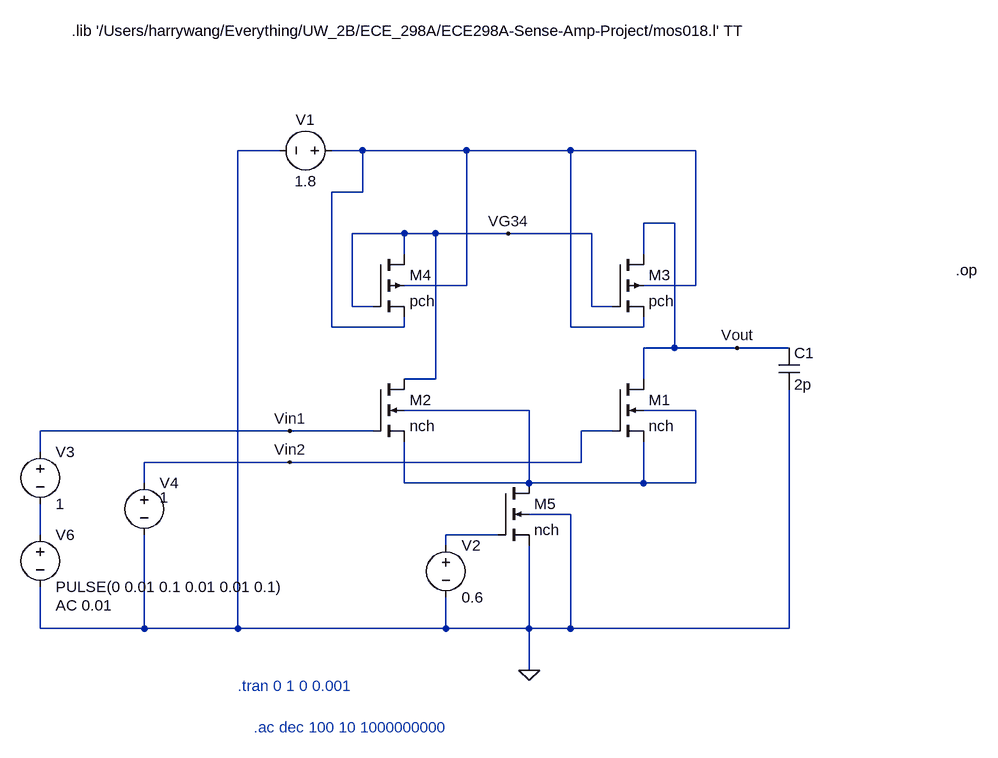
[diagram p0: schematic Sense_amp_alternate.asc]
Sense_amp_alternate.asc, the LTspice schematic file:
Version 4
SHEET 1 1660 680
WIRE -128 -256 -192 -256
WIRE 0 -256 -48 -256
WIRE 160 -256 0 -256
WIRE 320 -256 160 -256
WIRE 512 -256 320 -256
WIRE 0 -192 0 -256
WIRE 0 -192 -48 -192
WIRE 480 -144 432 -144
WIRE 64 -128 -16 -128
WIRE 112 -128 64 -128
WIRE 224 -128 112 -128
WIRE 352 -128 224 -128
WIRE 64 -96 64 -128
WIRE 432 -96 432 -144
WIRE 160 -48 160 -256
WIRE 160 -48 64 -48
WIRE 512 -48 512 -256
WIRE 512 -48 432 -48
WIRE -16 -16 -16 -128
WIRE 16 -16 -16 -16
WIRE 352 -16 352 -128
WIRE 384 -16 352 -16
WIRE -48 16 -48 -192
WIRE 64 16 64 0
WIRE 64 16 -48 16
WIRE 320 16 320 -256
WIRE 432 16 432 0
WIRE 432 16 320 16
WIRE 480 48 480 -144
WIRE 480 48 432 48
WIRE 576 48 480 48
WIRE 656 48 576 48
WIRE 112 96 112 -128
WIRE 112 96 64 96
WIRE 432 96 432 48
WIRE 256 144 64 144
WIRE 512 144 432 144
WIRE -112 176 -496 176
WIRE 16 176 -112 176
WIRE 384 176 336 176
WIRE -496 208 -496 176
WIRE -112 224 -336 224
WIRE 336 224 336 176
WIRE 336 224 -112 224
WIRE -336 256 -336 224
WIRE 64 256 64 192
WIRE 256 256 256 144
WIRE 256 256 64 256
WIRE 432 256 432 192
WIRE 432 256 256 256
WIRE 512 256 512 144
WIRE 512 256 432 256
WIRE 320 304 256 304
WIRE -496 336 -496 288
WIRE 208 336 128 336
WIRE 128 352 128 336
WIRE -496 480 -496 416
WIRE -336 480 -336 336
WIRE -336 480 -496 480
WIRE -192 480 -192 -256
WIRE -192 480 -336 480
WIRE 128 480 128 432
WIRE 128 480 -192 480
WIRE 256 480 256 352
WIRE 256 480 128 480
WIRE 320 480 320 304
WIRE 320 480 256 480
WIRE 656 480 656 112
WIRE 656 480 320 480
WIRE 256 544 256 480
FLAG 256 544 0
FLAG 576 48 Vout
FLAG -112 176 Vin1
FLAG -112 224 Vin2
FLAG 224 -128 VG34
SYMBOL voltage -32 -256 R90
WINDOW 0 -32 56 VBottom 2
WINDOW 3 32 56 VTop 2
WINDOW 123 0 0 Left 0
WINDOW 39 0 0 Left 0
SYMATTR InstName V1
SYMATTR Value 1.8
SYMBOL voltage 128 336 R0
WINDOW 123 0 0 Left 0
WINDOW 39 0 0 Left 0
SYMATTR InstName V2
SYMATTR Value 0.6
SYMBOL voltage -496 192 R0
WINDOW 123 0 0 Left 0
WINDOW 39 0 0 Left 0
SYMATTR Value 1
SYMATTR InstName V3
SYMBOL voltage -496 320 R0
WINDOW 123 24 124 Left 2
WINDOW 39 0 0 Left 0
SYMATTR Value2 AC 0.01
SYMATTR InstName V6
SYMATTR Value PULSE(0 0.01 0.1 0.01 0.01 0.1)
SYMBOL cap 640 48 R0
SYMATTR InstName C1
SYMATTR Value 2p
SYMBOL pmos4 384 -96 R0
SYMATTR InstName M3
SYMATTR Value pch
SYMATTR Value2 l=0.18e-6 w=1.0e-6
SYMBOL pmos4 16 -96 R0
SYMATTR InstName M4
SYMATTR Value pch
SYMATTR Value2 l=0.18e-6 w=1.0e-6
SYMBOL nmos4 384 96 R0
SYMATTR InstName M1
SYMATTR Value nch
SYMATTR Value2 l=0.18e-6 w=1.0e-6
SYMBOL nmos4 16 96 R0
SYMATTR InstName M2
SYMATTR Value nch
SYMATTR Value2 l=0.18e-6 w=1.0e-6
SYMBOL nmos4 208 256 R0
SYMATTR InstName M5
SYMATTR Value nch
SYMATTR Value2 l=0.32e-6 w=2.5e-6
SYMBOL voltage -336 240 R0
WINDOW 123 0 0 Left 0
WINDOW 39 0 0 Left 0
WINDOW 3 24 38 Left 2
SYMATTR Value 1
SYMATTR InstName V4
TEXT -192 568 Left 2 ;.tran 0 1 0 0.001
TEXT -168 632 Left 2 ;.ac dec 100 10 1000000000
TEXT -448 -440 Left 2 !.lib '/Users/harrywang/Everything/UW_2B/ECE_298A/ECE298A-Sense-Amp-Project/mos018.l' TT
TEXT 912 -72 Left 2 !.op

The netlist it stands for:
* Sense_amp_alternate.asc
V1 N001 0 1.8
V2 N004 0 0.6
V3 Vin1 N003 1
V6 N003 0 PULSE(0 0.01 0.1 0.01 0.01 0.1) AC 0.01
C1 Vout 0 2p
M3 Vout VG34 N001 N001 pch l=0.18e-6 w=1.0e-6
M4 VG34 VG34 N001 N001 pch l=0.18e-6 w=1.0e-6
M1 Vout Vin2 N002 N002 nch l=0.18e-6 w=1.0e-6
M2 VG34 Vin1 N002 N002 nch l=0.18e-6 w=1.0e-6
M5 N002 N004 0 0 nch l=0.32e-6 w=2.5e-6
V4 Vin2 0 1
.model NMOS NMOS
.model PMOS PMOS
.lib standard.mos
* .tran 0 1 0 0.001
* .ac dec 100 10 1000000000
.lib '/Users/harrywang/Everything/UW_2B/ECE_298A/ECE298A-Sense-Amp-Project/mos018.l' TT
.op
.backanno
.end